# EAGLE schematic avr32break120828 (EAGLE 5.11)

## Sheet 1 of 3
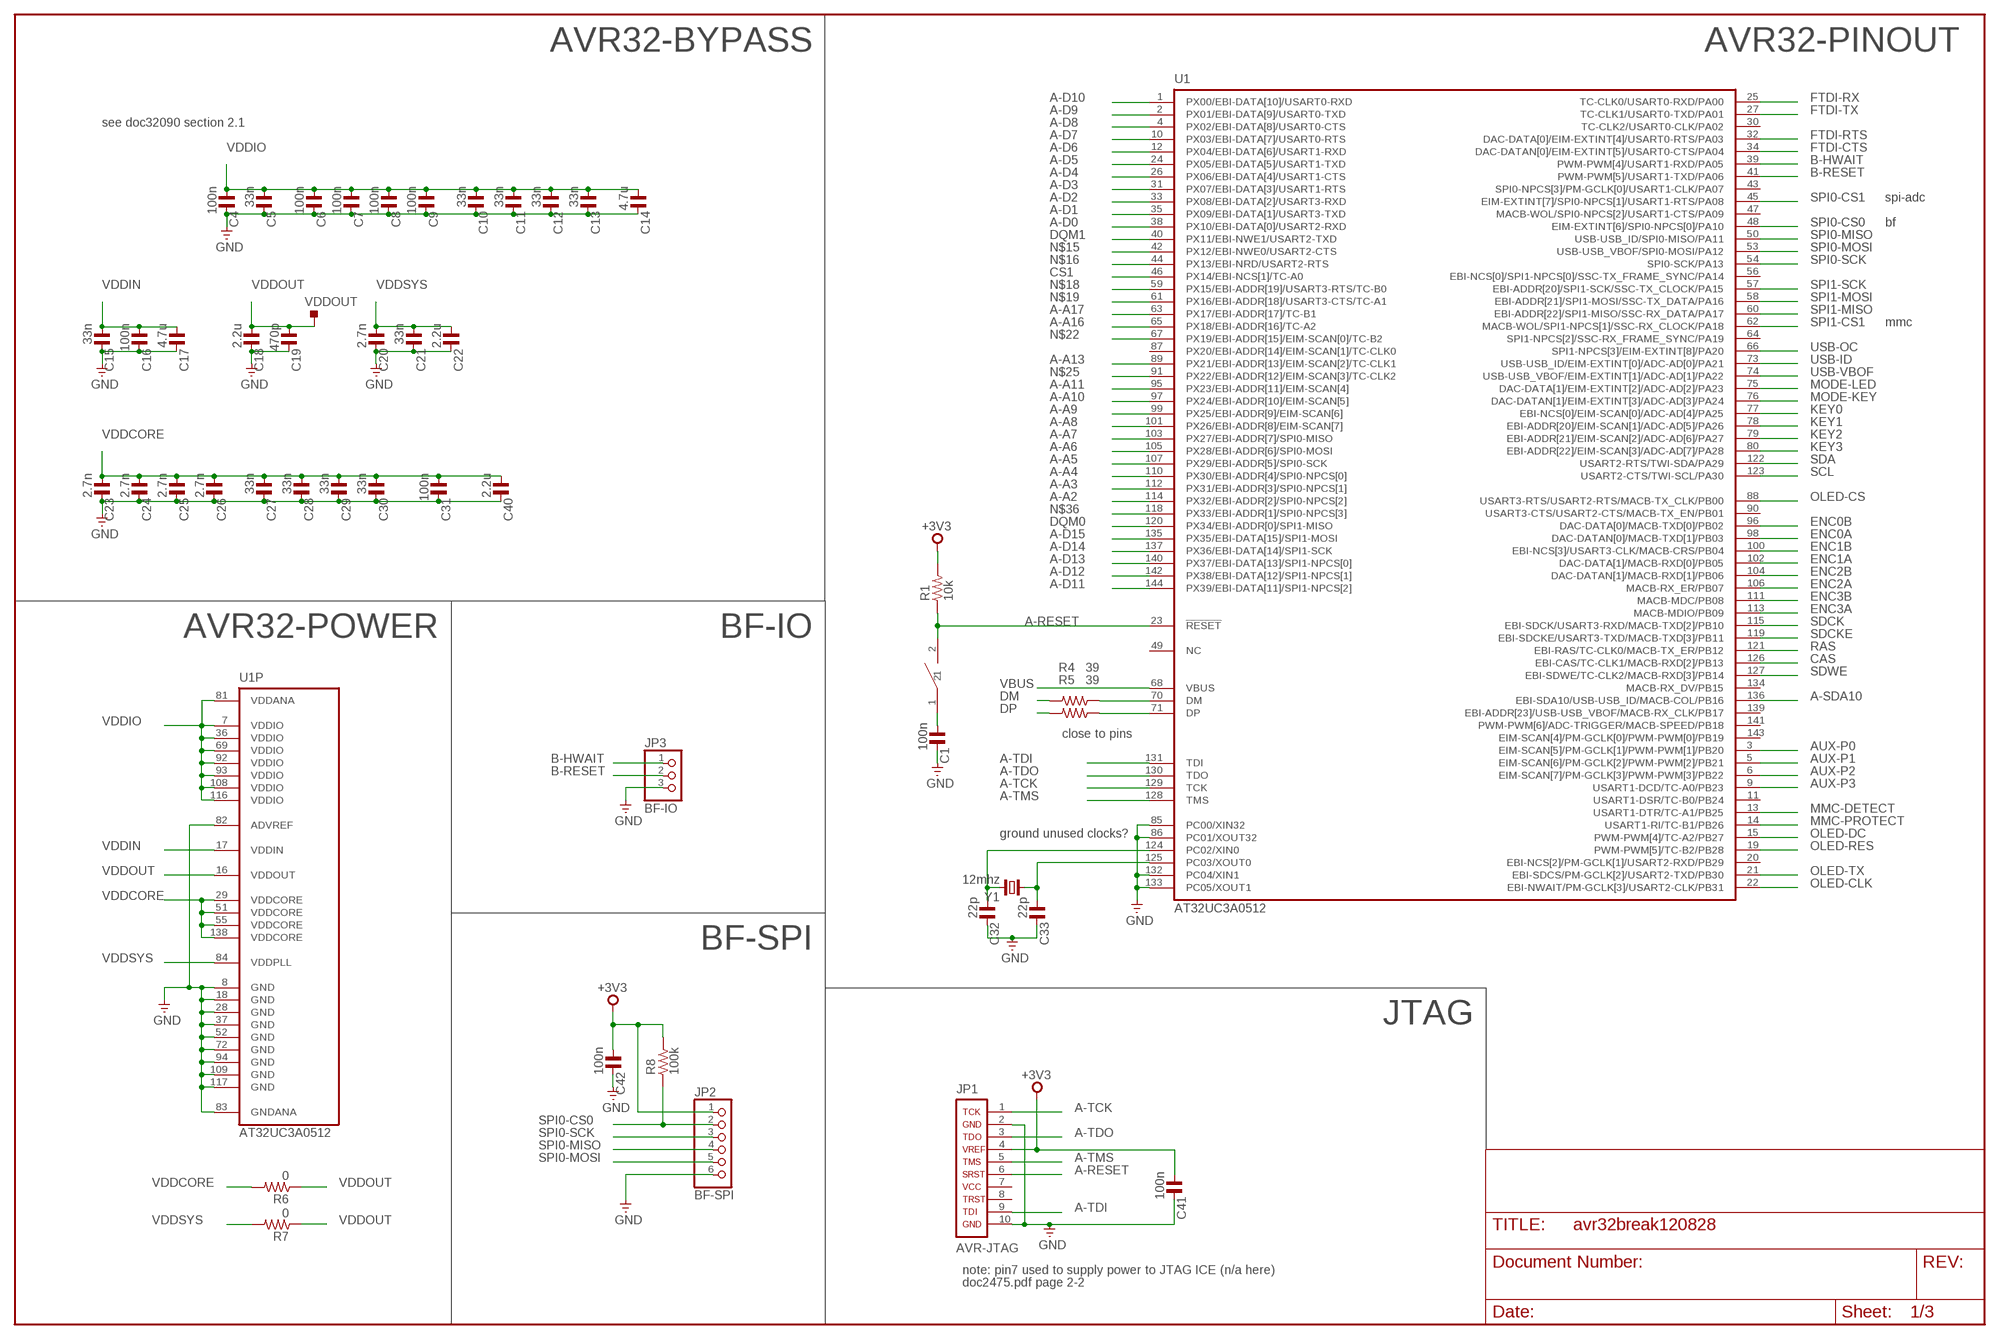
[diagram p0: schematic, sheet 1]

### Parts
C1  100n  C_0603  [C0603]
C4  100n  C_0603  [C0603]
C5  33n  C_0603  [C0603]
C6  100n  C_0603  [C0603]
C7  100n  C_0603  [C0603]
C8  100n  C_0603  [C0603]
C9  100n  C_0603  [C0603]
C10  33n  C_0603  [C0603]
C11  33n  C_0603  [C0603]
C12  33n  C_0603  [C0603]
C13  33n  C_0603  [C0603]
C14  4.7u  C_0603  [C0603]
C15  33n  C_0603  [C0603]
C16  100n  C_0603  [C0603]
C17  4.7u  C_0603  [C0603]
C18  2.2u  C_0603  [C0603]
C19  470p  C_0603  [C0603]
C20  2.7n  C_0603  [C0603]
C21  33n  C_0603  [C0603]
C22  2.2u  C_0603  [C0603]
C23  2.7n  C_0603  [C0603]
C24  2.7n  C_0603  [C0603]
C25  2.7n  C_0603  [C0603]
C26  2.7n  C_0603  [C0603]
C27  33n  C_0603  [C0603]
C28  33n  C_0603  [C0603]
C29  33n  C_0603  [C0603]
C30  33n  C_0603  [C0603]
C31  100n  C_0603  [C0603]
C32  22p  C_0603  [C0603]
C33  22p  C_0603  [C0603]
C40  2.2u  C_0603  [C0603]
C41  100n  C_0603  [C0603]
C42  100n  C_0603  [C0603]
JP1  AVR-JTAG  AVR-JTAG-10  [AVR-JTAG-10]
JP2  BF-SPI  PINHD-1X6  [1X06]
JP3  BF-IO  PINHD-1X3  [1X03]
R1  10k  R_0603  [R0603]
R4  39  R_0603  [R0603]
R5  39  R_0603  [R0603]
R6  0  R_0603  [R0603]
R7  0  R_0603  [R0603]
R8  100k  R_0603  [R0603]
U1  AT32UC3A0512  AT32UC3A0128/0256/0512  [LQFP144]
U$1  PANASONIC-EVQ  [PANASONIC-EVQ]
VDDOUT  TPS-SMD-15RN  [SMD-15RN]
Y1  12mhz  CRYTALHC49UP  [HC49UP]

### Nets
+3V3: C41.1 C42.1 JP1.4 JP2.1 R1.2 R8.2 ; also sheet 2,3
A-A2: U1.114(PX32/EBI-ADDR[2]/SPI0-NPCS[2]) ; also sheet 2
A-A3: U1.112(PX31/EBI-ADDR[3]/SPI0-NPCS[1]) ; also sheet 2
A-A4: U1.110(PX30/EBI-ADDR[4]/SPI0-NPCS[0]) ; also sheet 2
A-A5: U1.107(PX29/EBI-ADDR[5]/SPI0-SCK) ; also sheet 2
A-A6: U1.105(PX28/EBI-ADDR[6]/SPI0-MOSI) ; also sheet 2
A-A7: U1.103(PX27/EBI-ADDR[7]/SPI0-MISO) ; also sheet 2
A-A8: U1.101(PX26/EBI-ADDR[8]/EIM-SCAN[7]) ; also sheet 2
A-A9: U1.99(PX25/EBI-ADDR[9]/EIM-SCAN[6]) ; also sheet 2
A-A10: U1.97(PX24/EBI-ADDR[10]/EIM-SCAN[5]) ; also sheet 2
A-A11: U1.95(PX23/EBI-ADDR[11]/EIM-SCAN[4]) ; also sheet 2
A-A13: U1.89(PX21/EBI-ADDR[13]/EIM-SCAN[2]/TC-CLK1) ; also sheet 2
A-A16: U1.65(PX18/EBI-ADDR[16]/TC-A2) ; also sheet 2
A-A17: U1.63(PX17/EBI-ADDR[17]/TC-B1) ; also sheet 2
A-D0: U1.38(PX10/EBI-DATA[0]/USART2-RXD) ; also sheet 2
A-D1: U1.35(PX09/EBI-DATA[1]/USART3-TXD) ; also sheet 2
A-D2: U1.33(PX08/EBI-DATA[2]/USART3-RXD) ; also sheet 2
A-D3: U1.31(PX07/EBI-DATA[3]/USART1-RTS) ; also sheet 2
A-D4: U1.26(PX06/EBI-DATA[4]/USART1-CTS) ; also sheet 2
A-D5: U1.24(PX05/EBI-DATA[5]/USART1-TXD) ; also sheet 2
A-D6: U1.12(PX04/EBI-DATA[6]/USART1-RXD) ; also sheet 2
A-D7: U1.10(PX03/EBI-DATA[7]/USART0-RTS) ; also sheet 2
A-D8: U1.4(PX02/EBI-DATA[8]/USART0-CTS) ; also sheet 2
A-D9: U1.2(PX01/EBI-DATA[9]/USART0-TXD) ; also sheet 2
A-D10: U1.1(PX00/EBI-DATA[10]/USART0-RXD) ; also sheet 2
A-D11: U1.144(PX39/EBI-DATA[11]/SPI1-NPCS[2]) ; also sheet 2
A-D12: U1.142(PX38/EBI-DATA[12]/SPI1-NPCS[1]) ; also sheet 2
A-D13: U1.140(PX37/EBI-DATA[13]/SPI1-NPCS[0]) ; also sheet 2
A-D14: U1.137(PX36/EBI-DATA[14]/SPI1-SCK) ; also sheet 2
A-D15: U1.135(PX35/EBI-DATA[15]/SPI1-MOSI) ; also sheet 2
A-RESET: JP1.6 R1.1 U1.23(!RESET) U$1.2
A-SDA10: U1.136(EBI-SDA10/USB-USB_ID/MACB-COL/PB16) ; also sheet 2
A-TCK: JP1.1 U1.129(TCK)
A-TDI: JP1.9 U1.131(TDI)
A-TDO: JP1.3 U1.130(TDO)
A-TMS: JP1.5 U1.128(TMS)
AUX-P0: U1.3(EIM-SCAN[5]/PM-GCLK[1]/PWM-PWM[1]/PB20) ; also sheet 3
AUX-P1: U1.5(EIM-SCAN[6]/PM-GCLK[2]/PWM-PWM[2]/PB21) ; also sheet 3
AUX-P2: U1.6(EIM-SCAN[7]/PM-GCLK[3]/PWM-PWM[3]/PB22) ; also sheet 3
AUX-P3: U1.9(USART1-DCD/TC-A0/PB23) ; also sheet 3
B-HWAIT: JP3.1 U1.39(PWM-PWM[4]/USART1-RXD/PA05)
B-RESET: JP3.2 U1.41(PWM-PWM[5]/USART1-TXD/PA06)
CAS: U1.126(EBI-CAS/TC-CLK1/MACB-RXD[2]/PB13) ; also sheet 2
CS1: U1.46(PX14/EBI-NCS[1]/TC-A0) ; also sheet 2
DM: R4.2 ; also sheet 2
DP: R5.2 ; also sheet 2
DQM0: U1.120(PX34/EBI-ADDR[0]/SPI1-MISO) ; also sheet 2
DQM1: U1.40(PX11/EBI-NWE1/USART2-TXD) ; also sheet 2
ENC0A: U1.98(DAC-DATAN[0]/MACB-TXD[1]/PB03) ; also sheet 3
ENC0B: U1.96(DAC-DATA[0]/MACB-TXD[0]/PB02) ; also sheet 3
ENC1A: U1.102(DAC-DATA[1]/MACB-RXD[0]/PB05) ; also sheet 3
ENC1B: U1.100(EBI-NCS[3]/USART3-CLK/MACB-CRS/PB04) ; also sheet 3
ENC2A: U1.106(MACB-RX_ER/PB07) ; also sheet 3
ENC2B: U1.104(DAC-DATAN[1]/MACB-RXD[1]/PB06) ; also sheet 3
ENC3A: U1.113(MACB-MDIO/PB09) ; also sheet 3
ENC3B: U1.111(MACB-MDC/PB08) ; also sheet 3
FTDI-CTS: U1.34(DAC-DATAN[0]/EIM-EXTINT[5]/USART0-CTS/PA04) ; also sheet 2
FTDI-RTS: U1.32(DAC-DATA[0]/EIM-EXTINT[4]/USART0-RTS/PA03) ; also sheet 2
FTDI-RX: U1.25(TC-CLK0/USART0-RXD/PA00) ; also sheet 2
FTDI-TX: U1.27(TC-CLK1/USART0-TXD/PA01) ; also sheet 2
GND: C1.2 C4.2 C5.2 C6.2 C7.2 C8.2 C9.2 C10.2 C11.2 C12.2 C13.2 C14.2 C15.2 C16.2 C17.2 C18.2 C19.2 C20.2 C21.2 C22.2 C23.2 C24.2 C25.2 C26.2 C27.2 C28.2 C29.2 C30.2 C31.2 C32.2 C33.2 C40.2 C41.2 C42.2 JP1.2 JP1.10 JP2.6 JP3.3 U1.8(GND) U1.18(GND) U1.28(GND) U1.37(GND) U1.52(GND) U1.72(GND) U1.82(ADVREF) U1.83(GNDANA) U1.85(PC00/XIN32) U1.86(PC01/XOUT32) U1.94(GND) U1.109(GND) U1.117(GND) U1.132(PC04/XIN1) U1.133(PC05/XOUT1) ; also sheet 2,3
KEY0: U1.77(EBI-NCS[0]/EIM-SCAN[0]/ADC-AD[4]/PA25) ; also sheet 3
KEY1: U1.78(EBI-ADDR[20]/EIM-SCAN[1]/ADC-AD[5]/PA26) ; also sheet 3
KEY2: U1.79(EBI-ADDR[21]/EIM-SCAN[2]/ADC-AD[6]/PA27) ; also sheet 3
KEY3: U1.80(EBI-ADDR[22]/EIM-SCAN[3]/ADC-AD[7]/PA28) ; also sheet 3
MMC-DETECT: U1.13(USART1-DTR/TC-A1/PB25) ; also sheet 2
MMC-PROTECT: U1.14(USART1-RI/TC-B1/PB26) ; also sheet 2
MODE-KEY: U1.76(DAC-DATAN[1]/EIM-EXTINT[3]/ADC-AD[3]/PA24) ; also sheet 3
MODE-LED: U1.75(DAC-DATA[1]/EIM-EXTINT[2]/ADC-AD[2]/PA23) ; also sheet 3
N$2: C1.1 U$1.1
N$4: C32.1 U1.124(PC02/XIN0) Y1.2
N$5: C33.1 U1.125(PC03/XOUT0) Y1.1
N$15: U1.42(PX12/EBI-NWE0/USART2-CTS)
N$16: U1.44(PX13/EBI-NRD/USART2-RTS)
N$18: U1.59(PX15/EBI-ADDR[19]/USART3-RTS/TC-B0)
N$19: U1.61(PX16/EBI-ADDR[18]/USART3-CTS/TC-A1)
N$22: U1.67(PX19/EBI-ADDR[15]/EIM-SCAN[0]/TC-B2)
N$25: U1.91(PX22/EBI-ADDR[12]/EIM-SCAN[3]/TC-CLK2)
N$36: U1.118(PX33/EBI-ADDR[1]/SPI0-NPCS[3])
N$44: R4.1 U1.70(DM)
N$45: R5.1 U1.71(DP)
OLED-CLK: U1.22(EBI-NWAIT/PM-GCLK[3]/USART2-CLK/PB31) ; also sheet 3
OLED-CS: U1.88(USART3-RTS/USART2-RTS/MACB-TX_CLK/PB00) ; also sheet 3
OLED-DC: U1.15(PWM-PWM[4]/TC-A2/PB27) ; also sheet 3
OLED-RES: U1.19(PWM-PWM[5]/TC-B2/PB28) ; also sheet 3
OLED-TX: U1.21(EBI-SDCS/PM-GCLK[2]/USART2-TXD/PB30) ; also sheet 3
RAS: U1.121(EBI-RAS/TC-CLK0/MACB-TX_ER/PB12) ; also sheet 2
SCL: U1.123(USART2-CTS/TWI-SCL/PA30) ; also sheet 3
SDA: U1.122(USART2-RTS/TWI-SDA/PA29) ; also sheet 3
SDCK: U1.115(EBI-SDCK/USART3-RXD/MACB-TXD[2]/PB10) ; also sheet 2
SDCKE: U1.119(EBI-SDCKE/USART3-TXD/MACB-TXD[3]/PB11) ; also sheet 2
SDWE: U1.127(EBI-SDWE/TC-CLK2/MACB-RXD[3]/PB14) ; also sheet 2
SPI0-CS0: JP2.2 R8.1 U1.48(EIM-EXTINT[6]/SPI0-NPCS[0]/PA10)
SPI0-CS1: U1.45(EIM-EXTINT[7]/SPI0-NPCS[1]/USART1-RTS/PA08) ; also sheet 3
SPI0-MISO: JP2.4 U1.50(USB-USB_ID/SPI0-MISO/PA11)
SPI0-MOSI: JP2.5 U1.53(USB-USB_VBOF/SPI0-MOSI/PA12) ; also sheet 3
SPI0-SCK: JP2.3 U1.54(SPI0-SCK/PA13) ; also sheet 3
SPI1-CS1: U1.62(MACB-WOL/SPI1-NPCS[1]/SSC-RX_CLOCK/PA18) ; also sheet 2
SPI1-MISO: U1.60(EBI-ADDR[22]/SPI1-MISO/SSC-RX_DATA/PA17) ; also sheet 2
SPI1-MOSI: U1.58(EBI-ADDR[21]/SPI1-MOSI/SSC-TX_DATA/PA16) ; also sheet 2
SPI1-SCK: U1.57(EBI-ADDR[20]/SPI1-SCK/SSC-TX_CLOCK/PA15) ; also sheet 2
USB-ID: U1.73(USB-USB_ID/EIM-EXTINT[0]/ADC-AD[0]/PA21)
USB-OC: U1.66(SPI1-NPCS[3]/EIM-EXTINT[8]/PA20) ; also sheet 2
USB-VBOF: U1.74(USB-USB_VBOF/EIM-EXTINT[1]/ADC-AD[1]/PA22) ; also sheet 2
VBUS: U1.68(VBUS) ; also sheet 2
VDDCORE: C23.1 C24.1 C25.1 C26.1 C27.1 C28.1 C29.1 C30.1 C31.1 C40.1 R6.2 U1.29(VDDCORE) U1.51(VDDCORE) U1.55(VDDCORE) U1.138(VDDCORE)
VDDIN: C15.1 C16.1 C17.1 U1.17(VDDIN) ; also sheet 2
VDDIO: C4.1 C5.1 C6.1 C7.1 C8.1 C9.1 C10.1 C11.1 C12.1 C13.1 C14.1 U1.7(VDDIO) U1.36(VDDIO) U1.69(VDDIO) U1.81(VDDANA) U1.92(VDDIO) U1.93(VDDIO) U1.108(VDDIO) U1.116(VDDIO) ; also sheet 2
VDDOUT: C18.1 C19.1 R6.1 R7.1 U1.16(VDDOUT) VDDOUT.TP
VDDSYS: C20.1 C21.1 C22.1 R7.2 U1.84(VDDPLL)
Unconnected: JP1.7 JP1.8 U1.11(USART1-DSR/TC-B0/PB24) U1.20(EBI-NCS[2]/PM-GCLK[1]/USART2-RXD/PB29) U1.30(TC-CLK2/USART0-CLK/PA02) U1.43(SPI0-NPCS[3]/PM-GCLK[0]/USART1-CLK/PA07) U1.47(MACB-WOL/SPI0-NPCS[2]/USART1-CTS/PA09) U1.49(NC) U1.56(EBI-NCS[0]/SPI1-NPCS[0]/SSC-TX_FRAME_SYNC/PA14) U1.64(SPI1-NPCS[2]/SSC-RX_FRAME_SYNC/PA19) U1.87(PX20/EBI-ADDR[14]/EIM-SCAN[1]/TC-CLK0) U1.90(USART3-CTS/USART2-CTS/MACB-TX_EN/PB01) U1.134(MACB-RX_DV/PB15) U1.139(EBI-ADDR[23]/USB-USB_VBOF/MACB-RX_CLK/PB17) U1.141(PWM-PWM[6]/ADC-TRIGGER/MACB-SPEED/PB18) U1.143(EIM-SCAN[4]/PM-GCLK[0]/PWM-PWM[0]/PB19)

### Notes on the sheet
- AVR32-BYPASS | AVR32-PINOUT
- see doc32090 section 2.1
- spi-adc
- bf
- mmc
- AVR32-POWER | BF-IO
- close to pins
- ground unused clocks?
- BF-SPI
- JTAG
- note: pin7 used to supply power to JTAG ICE (n/a here)
- doc2475.pdf page 2-2

## Sheet 2 of 3
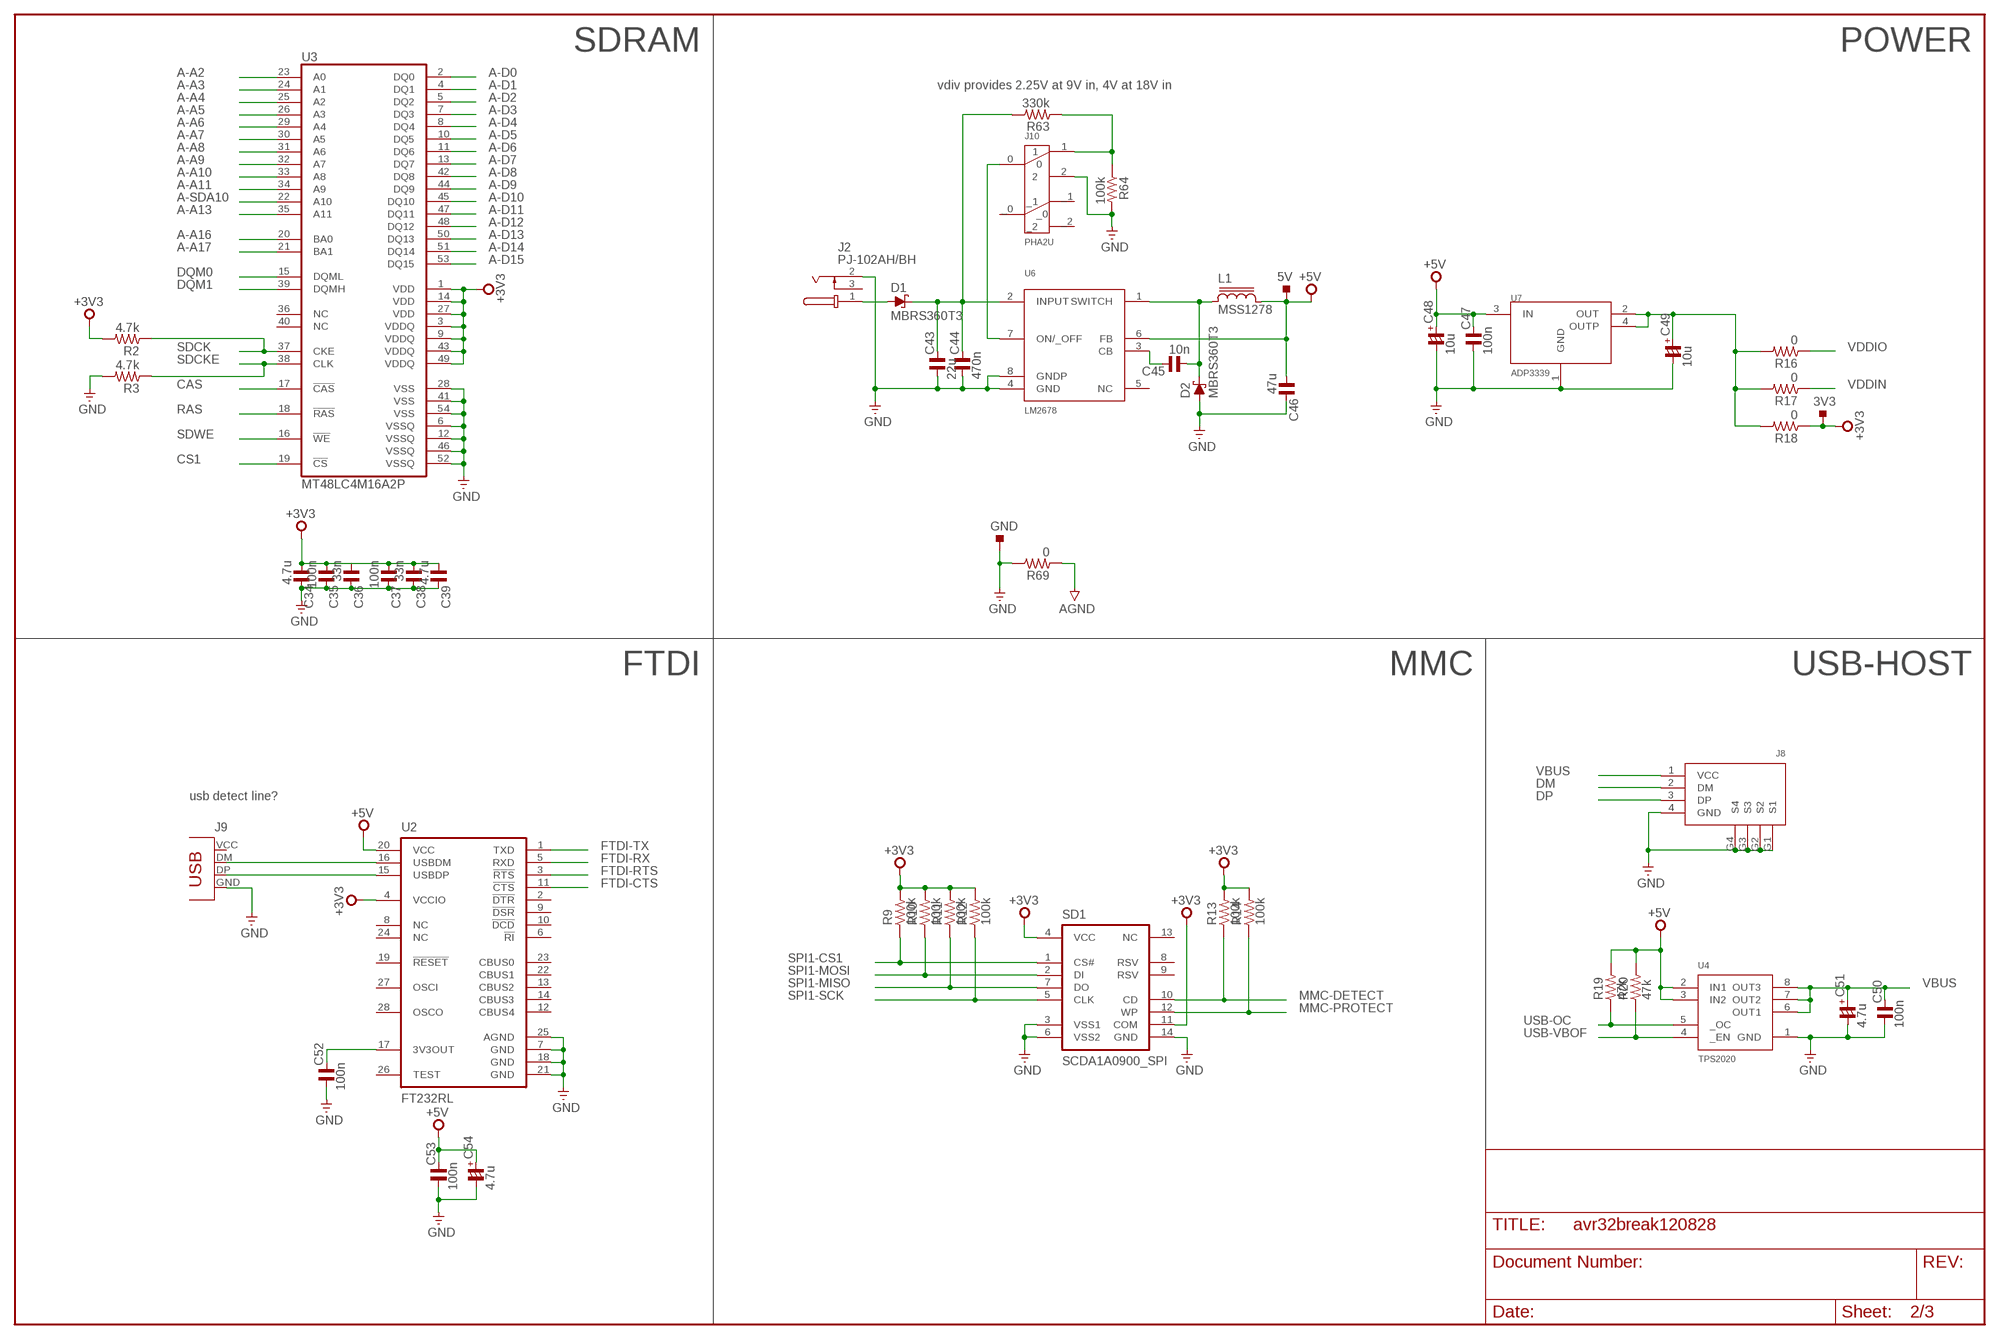
[diagram p1: schematic, sheet 2]

### Parts
3V3  TPS-SMD-15R  [SMD-15R]
5V  TPS-SMD-15R  [SMD-15R]
C34  4.7u  C_0603  [C0603]
C35  100n  C_0603  [C0603]
C36  33n  C_0603  [C0603]
C37  100n  C_0603  [C0603]
C38  33n  C_0603  [C0603]
C39  4.7u  C_0603  [C0603]
C43  22u  C_1206  [C1206]
C44  470n  C_1206  [C1206]
C45  10n  C_1206  [C1206]
C46  47u  C_3225  [C3225]
C47  100n  C_1206  [C1206]
C48  10u  CP_1206/T  [C1206/T]
C49  10u  CP_1206/T  [C1206/T]
C50  100n  C_0603  [C0603]
C51  4.7u  CP_1206/T  [C1206/T]
C52  100n  C_0603  [C0603]
C53  100n  C_0603  [C0603]
C54  4.7u  CP_1206/T  [C1206/T]
D1  MBRS360T3  [SMC]
D2  MBRS360T3  [SMC]
GND  TPS-SMD-20R  [SMD-20R]
J2  PJ-102AH/BH  [PJ-102XH]
J8  USBA-VERT  [USBA-VERT]
J9  USB_TYPE_B  [USB_B]
J10  PHA2U  [PHA2U]
L1  MSS1278  [MSS1278]
R2  4.7k  R_0603  [R0603]
R3  4.7k  R_0603  [R0603]
R9  100k  R_0603  [R0603]
R10  100k  R_0603  [R0603]
R11  100k  R_0603  [R0603]
R12  100k  R_0603  [R0603]
R13  100k  R_0603  [R0603]
R14  100k  R_0603  [R0603]
R16  0  R_0603  [R0603]
R17  0  R_0603  [R0603]
R18  0  R_0603  [R0603]
R19  47k  R_0603  [R0603]
R20  47k  R_0603  [R0603]
R63  330k  R_0603  [R0603]
R64  100k  R_0603  [R0603]
R69  0  R_0603  [R0603]
SD1  SCDA1A0900_SPI  [SCDA1A0900]
U2  FT232RL  [SSOP28]
U3  MT48LC4M16A2P  [TSOP54]
U4  TPS2020  [SO08]
U6  LM2678  [TO263-7]
U7  ADP3339  [SOT223]

### Nets
+3V3: 3V3.TP C34.1 C35.1 C36.1 C37.1 C38.1 C39.1 R2.2 R9.2 R10.2 R11.2 R12.2 R13.2 R14.2 R18.1 SD1.4(VCC) SD1.11(COM) U2.4(VCCIO) U3.1(VDD) U3.3(VDDQ) U3.9(VDDQ) U3.14(VDD) U3.27(VDD) U3.43(VDDQ) U3.49(VDDQ) ; also sheet 1,3
+5V: 5V.TP C46.1 C47.2 C48.+ C53.2 C54.+ L1.2 R19.2 R20.2 U2.20(VCC) U4.2(IN1) U4.3(IN2) U6.6(FB) U7.3(IN) ; also sheet 3
A-A2: U3.23(A0) ; also sheet 1
A-A3: U3.24(A1) ; also sheet 1
A-A4: U3.25(A2) ; also sheet 1
A-A5: U3.26(A3) ; also sheet 1
A-A6: U3.29(A4) ; also sheet 1
A-A7: U3.30(A5) ; also sheet 1
A-A8: U3.31(A6) ; also sheet 1
A-A9: U3.32(A7) ; also sheet 1
A-A10: U3.33(A8) ; also sheet 1
A-A11: U3.34(A9) ; also sheet 1
A-A13: U3.35(A11) ; also sheet 1
A-A16: U3.20(BA0) ; also sheet 1
A-A17: U3.21(BA1) ; also sheet 1
A-D0: U3.2(DQ0) ; also sheet 1
A-D1: U3.4(DQ1) ; also sheet 1
A-D2: U3.5(DQ2) ; also sheet 1
A-D3: U3.7(DQ3) ; also sheet 1
A-D4: U3.8(DQ4) ; also sheet 1
A-D5: U3.10(DQ5) ; also sheet 1
A-D6: U3.11(DQ6) ; also sheet 1
A-D7: U3.13(DQ7) ; also sheet 1
A-D8: U3.42(DQ8) ; also sheet 1
A-D9: U3.44(DQ9) ; also sheet 1
A-D10: U3.45(DQ10) ; also sheet 1
A-D11: U3.47(DQ11) ; also sheet 1
A-D12: U3.48(DQ12) ; also sheet 1
A-D13: U3.50(DQ13) ; also sheet 1
A-D14: U3.51(DQ14) ; also sheet 1
A-D15: U3.53(DQ15) ; also sheet 1
A-SDA10: U3.22(A10) ; also sheet 1
AGND: R69.1 ; also sheet 3
CAS: U3.17(!CAS!) ; also sheet 1
CS1: U3.19(!CS!) ; also sheet 1
DM: J8.2(DM) ; also sheet 1
DP: J8.3(DP) ; also sheet 1
DQM0: U3.15(DQML) ; also sheet 1
DQM1: U3.39(DQMH) ; also sheet 1
FTDI-CTS: U2.11(!CTS!) ; also sheet 1
FTDI-RTS: U2.3(!RTS!) ; also sheet 1
FTDI-RX: U2.5(RXD) ; also sheet 1
FTDI-TX: U2.1(TXD) ; also sheet 1
GND: C34.2 C35.2 C36.2 C37.2 C38.2 C39.2 C43.1 C44.1 C46.2 C47.1 C48.- C49.- C50.1 C51.- C52.1 C53.1 C54.- D2.A GND.TP J2.2(S) J8.4(GND) J8.G1(S1) J8.G2(S2) J8.G3(S3) J8.G4(S4) J9.GND J10.2 R3.2 R64.2 R69.2 SD1.3(VSS1) SD1.6(VSS2) SD1.14(GND) U2.7(GND) U2.18(GND) U2.21(GND) U2.25(AGND) U3.6(VSSQ) U3.12(VSSQ) U3.28(VSS) U3.41(VSS) U3.46(VSSQ) U3.52(VSSQ) U3.54(VSS) U4.1(GND) U6.4(GND) U6.8(GNDP) U7.1(GND) ; also sheet 1,3
MMC-DETECT: R13.1 SD1.10(CD) ; also sheet 1
MMC-PROTECT: R14.1 SD1.12(WP) ; also sheet 1
N$1: C43.2 C44.2 D1.C R63.2 U6.2(INPUT)
N$3: D1.A J2.1(T)
N$7: C45.1 D2.C L1.1 U6.1(SWITCH)
N$9: C45.2 U6.3(CB)
N$12: J9.DM(USBDM) U2.16(USBDM)
N$13: J9.DP(USBDP) U2.15(USBDP)
N$14: C52.2 U2.17(3V3OUT)
N$32: C49.+ R16.2 R17.2 R18.2 U7.2(OUT) U7.4(OUTP)
N$55: J10.1 R63.1 R64.1
N$56: J10.0 U6.7(ON/_OFF)
RAS: U3.18(!RAS!) ; also sheet 1
SDCK: R2.1 U3.37(CKE) ; also sheet 1
SDCKE: R3.1 U3.38(CLK) ; also sheet 1
SDWE: U3.16(!WE!) ; also sheet 1
SPI1-CS1: R9.1 SD1.1(CS#) ; also sheet 1
SPI1-MISO: R11.1 SD1.7(DO) ; also sheet 1
SPI1-MOSI: R10.1 SD1.2(DI) ; also sheet 1
SPI1-SCK: R12.1 SD1.5(CLK) ; also sheet 1
USB-OC: R19.1 U4.5(_OC) ; also sheet 1
USB-VBOF: R20.1 U4.4(_EN) ; also sheet 1
VBUS: C50.2 C51.+ J8.1(VCC) U4.6(OUT1) U4.7(OUT2) U4.8(OUT3) ; also sheet 1
VDDIN: R17.1 ; also sheet 1
VDDIO: R16.1 ; also sheet 1
Unconnected: J2.3(SS) J9.VCC J10._0 J10._1 J10._2 SD1.8(RSV) SD1.9(RSV2) SD1.13(NC) U2.2(!DTR!) U2.6(!RI!) U2.8(NC) U2.9(!DSR!) U2.10(!DCD!) U2.12(CBUS4) U2.13(CBUS2) U2.14(CBUS3) U2.19(!RESET!) U2.22(CBUS1) U2.23(CBUS0) U2.24(NC) U2.26(TEST) U2.27(OSCI) U2.28(OSCO) U3.36(NC) U3.40(NC) U6.5(NC)

### Notes on the sheet
- SDRAM | POWER
- vdiv provides 2.25V at 9V in, 4V at 18V in
- FTDI | MMC | USB-HOST
- usb detect line?

## Sheet 3 of 3
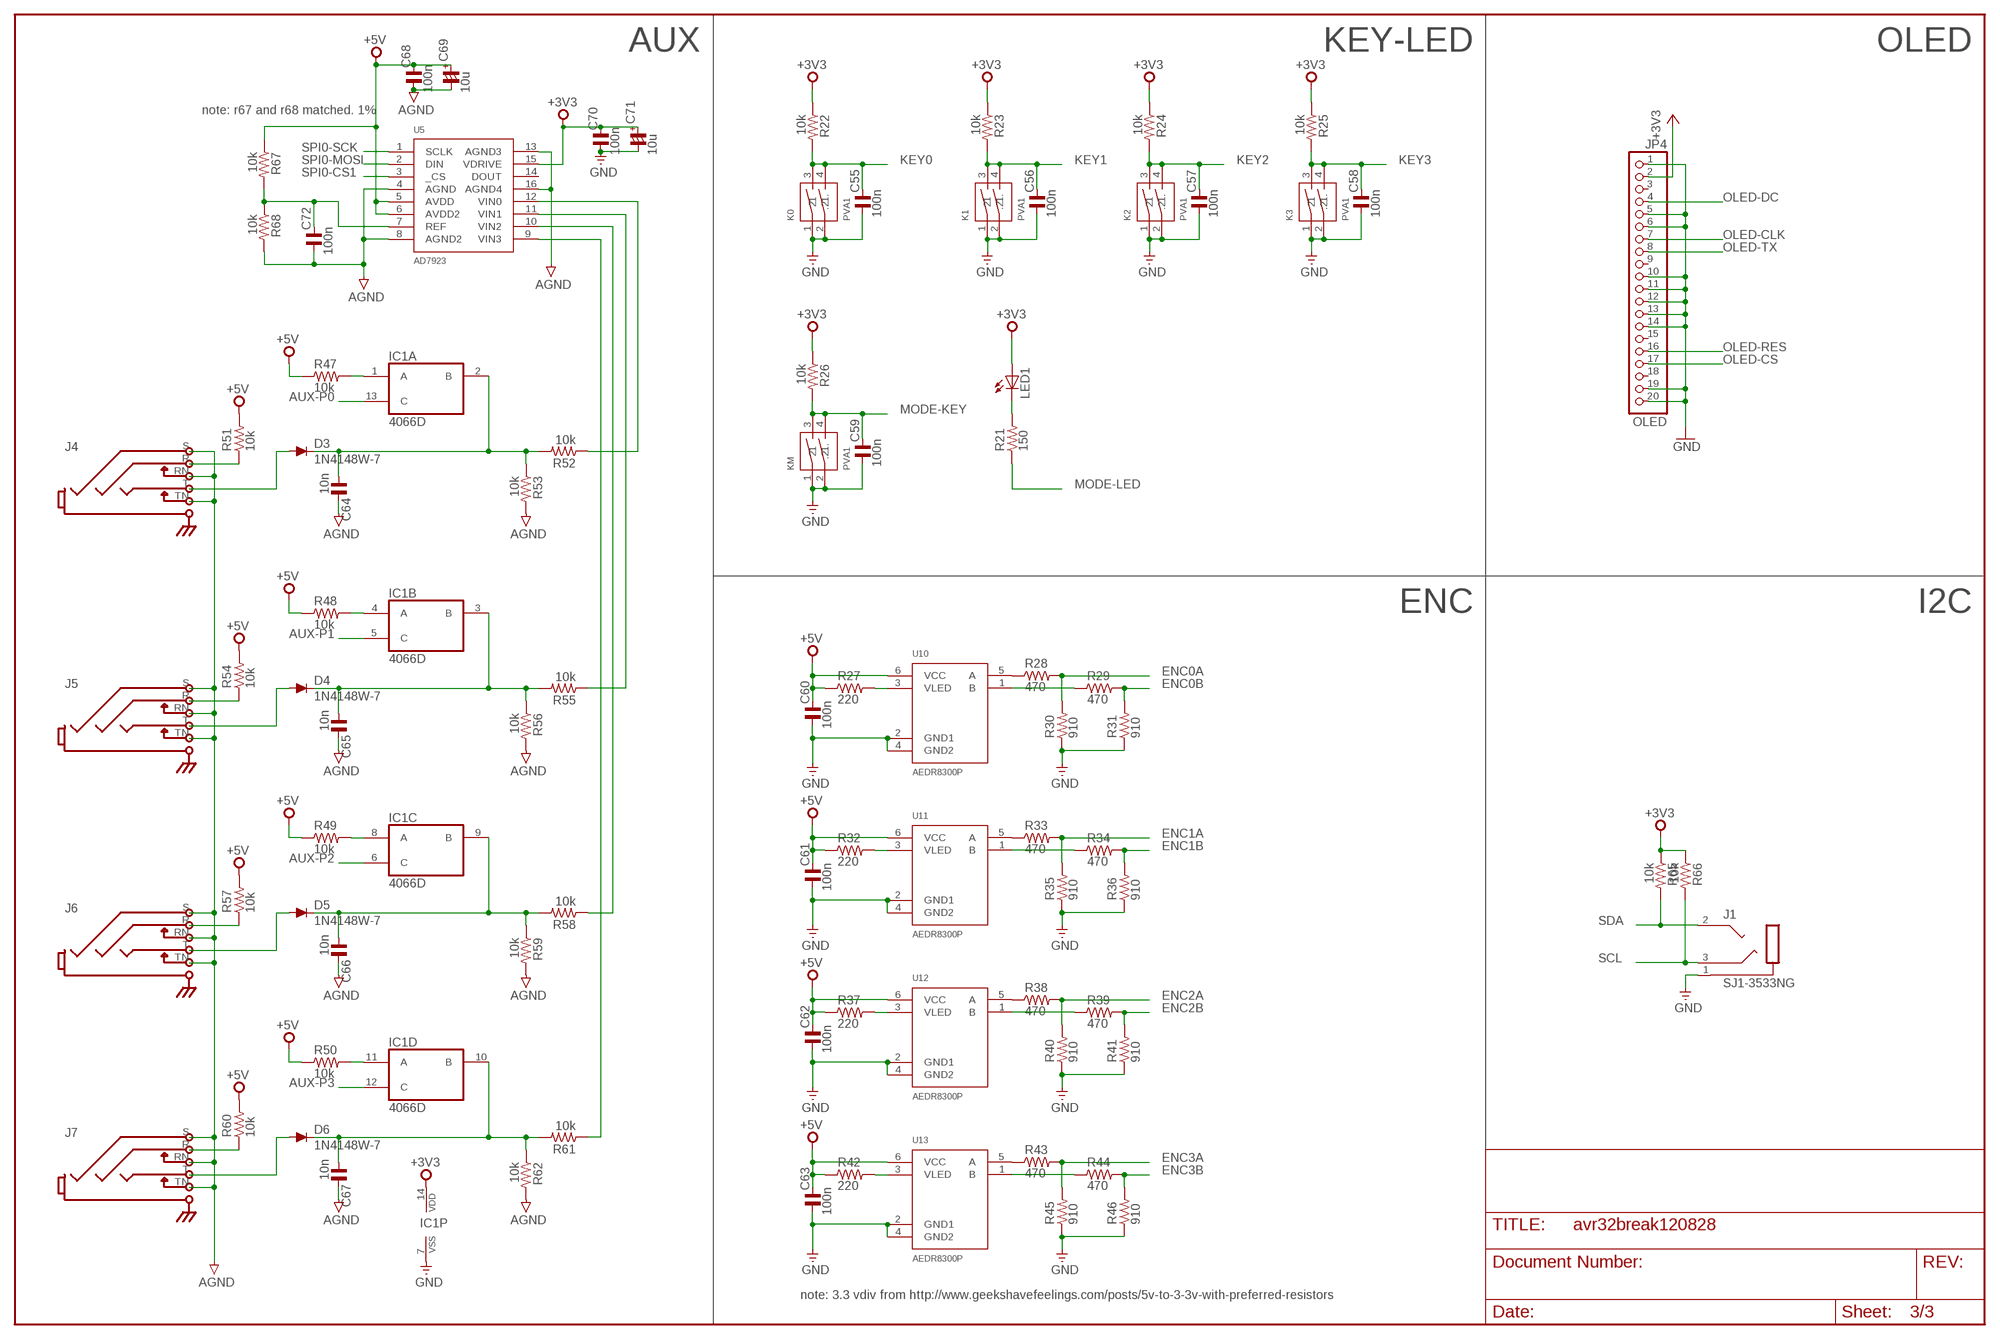
[diagram p2: schematic, sheet 3]

### Parts
C55  100n  C_0603  [C0603]
C56  100n  C_0603  [C0603]
C57  100n  C_0603  [C0603]
C58  100n  C_0603  [C0603]
C59  100n  C_0603  [C0603]
C60  100n  C_0603  [C0603]
C61  100n  C_0603  [C0603]
C62  100n  C_0603  [C0603]
C63  100n  C_0603  [C0603]
C64  10n  C_0603  [C0603]
C65  10n  C_0603  [C0603]
C66  10n  C_0603  [C0603]
C67  10n  C_0603  [C0603]
C68  100n  C_0603  [C0603]
C69  10u  CP_1206/T  [C1206/T]
C70  100n  C_0603  [C0603]
C71  10u  CP_1206/T  [C1206/T]
C72  100n  C_0603  [C0603]
D3  1N4148W-7  [SOD123]
D4  1N4148W-7  [SOD123]
D5  1N4148W-7  [SOD123]
D6  1N4148W-7  [SOD123]
IC1  4066D  [SO14]
J1  SJ1-3533NG  [SJ1-3533NG]
J4  STEREOSW2GND  [NEUTRIK-NRJ6HM-1]
J5  STEREOSW2GND  [NEUTRIK-NRJ6HM-1]
J6  STEREOSW2GND  [NEUTRIK-NRJ6HM-1]
J7  STEREOSW2GND  [NEUTRIK-NRJ6HM-1]
JP4  OLED  PINHD-1X20  [1X20]
K0  PVA1  [PVA1]
K1  PVA1  [PVA1]
K2  PVA1  [PVA1]
K3  PVA1  [PVA1]
KM  PVA1  [PVA1]
LED1  LEDCHIPLED_1206  [CHIPLED_1206]
R21  150  R_0603  [R0603]
R22  10k  R_0603  [R0603]
R23  10k  R_0603  [R0603]
R24  10k  R_0603  [R0603]
R25  10k  R_0603  [R0603]
R26  10k  R_0603  [R0603]
R27  220  R_0603  [R0603]
R28  470  R_0603  [R0603]
R29  470  R_0603  [R0603]
R30  910  R_0603  [R0603]
R31  910  R_0603  [R0603]
R32  220  R_0603  [R0603]
R33  470  R_0603  [R0603]
R34  470  R_0603  [R0603]
R35  910  R_0603  [R0603]
R36  910  R_0603  [R0603]
R37  220  R_0603  [R0603]
R38  470  R_0603  [R0603]
R39  470  R_0603  [R0603]
R40  910  R_0603  [R0603]
R41  910  R_0603  [R0603]
R42  220  R_0603  [R0603]
R43  470  R_0603  [R0603]
R44  470  R_0603  [R0603]
R45  910  R_0603  [R0603]
R46  910  R_0603  [R0603]
R47  10k  R_0603  [R0603]
R48  10k  R_0603  [R0603]
R49  10k  R_0603  [R0603]
R50  10k  R_0603  [R0603]
R51  10k  R_0603  [R0603]
R52  10k  R_0603  [R0603]
R53  10k  R_0603  [R0603]
R54  10k  R_0603  [R0603]
R55  10k  R_0603  [R0603]
R56  10k  R_0603  [R0603]
R57  10k  R_0603  [R0603]
R58  10k  R_0603  [R0603]
R59  10k  R_0603  [R0603]
R60  10k  R_0603  [R0603]
R61  10k  R_0603  [R0603]
R62  10k  R_0603  [R0603]
R65  10k  R_0603  [R0603]
R66  10k  R_0603  [R0603]
R67  10k  R_0603  [R0603]
R68  10k  R_0603  [R0603]
U5  AD7923  [TSSOP16]
U10  AEDR8300P  [AEDR8300]
U11  AEDR8300P  [AEDR8300]
U12  AEDR8300P  [AEDR8300]
U13  AEDR8300P  [AEDR8300]

### Nets
+3V3: C70.2 C71.+ IC1.14(P:VDD) JP4.2 LED1.A R22.1 R23.1 R24.1 R25.1 R26.1 R65.1 R66.1 U5.15(VDRIVE) ; also sheet 1,2
+5V: C60.2 C61.2 C62.2 C63.2 C68.2 C69.+ R27.1 R32.1 R37.1 R42.1 R47.1 R48.1 R49.1 R50.1 R51.2 R54.2 R57.2 R60.2 R67.1 U5.5(AVDD) U5.6(AVDD2) U10.6(VCC) U11.6(VCC) U12.6(VCC) U13.6(VCC) ; also sheet 2
AGND: C64.2 C65.2 C66.2 C67.2 C68.1 C69.- C72.1 J4.RN J4.S J4.TN J5.RN J5.S J5.TN J6.RN J6.S J6.TN J7.RN J7.S J7.TN R53.2 R56.2 R59.2 R62.2 R68.2 U5.4(AGND) U5.8(AGND2) U5.13(AGND3) U5.16(AGND4) ; also sheet 2
AUX-P0: IC1.13(A:C) ; also sheet 1
AUX-P1: IC1.5(B:C) ; also sheet 1
AUX-P2: IC1.6(C:C) ; also sheet 1
AUX-P3: IC1.12(D:C) ; also sheet 1
ENC0A: R28.2 R30.2 ; also sheet 1
ENC0B: R29.2 R31.2 ; also sheet 1
ENC1A: R33.2 R35.2 ; also sheet 1
ENC1B: R34.2 R36.2 ; also sheet 1
ENC2A: R38.2 R40.2 ; also sheet 1
ENC2B: R39.2 R41.2 ; also sheet 1
ENC3A: R43.2 R45.2 ; also sheet 1
ENC3B: R44.2 R46.2 ; also sheet 1
GND: C55.1 C56.1 C57.1 C58.1 C59.1 C60.1 C61.1 C62.1 C63.1 C70.1 C71.- IC1.7(P:VSS) J1.1(S) JP4.1 JP4.5 JP4.6 JP4.10 JP4.11 JP4.12 JP4.13 JP4.14 JP4.19 JP4.20 K0.1 K0.2(1.) K1.1 K1.2(1.) K2.1 K2.2(1.) K3.1 K3.2(1.) KM.1 KM.2(1.) R30.1 R31.1 R35.1 R36.1 R40.1 R41.1 R45.1 R46.1 U10.2(GND1) U10.4(GND2) U11.2(GND1) U11.4(GND2) U12.2(GND1) U12.4(GND2) U13.2(GND1) U13.4(GND2) ; also sheet 1,2
KEY0: C55.2 K0.3 K0.4(.2) R22.2 ; also sheet 1
KEY1: C56.2 K1.3 K1.4(.2) R23.2 ; also sheet 1
KEY2: C57.2 K2.3 K2.4(.2) R24.2 ; also sheet 1
KEY3: C58.2 K3.3 K3.4(.2) R25.2 ; also sheet 1
MODE-KEY: C59.2 KM.3 KM.4(.2) R26.2 ; also sheet 1
MODE-LED: R21.1 ; also sheet 1
N$6: R27.2 U10.3(VLED)
N$8: R28.1 U10.5(A)
N$11: R32.2 U11.3(VLED)
N$17: R33.1 U11.5(A)
N$20: LED1.C R21.2
N$21: R29.1 U10.1(B)
N$23: R34.1 U11.1(B)
N$24: R37.2 U12.3(VLED)
N$26: R38.1 U12.5(A)
N$27: R39.1 U12.1(B)
N$28: R42.2 U13.3(VLED)
N$29: R43.1 U13.5(A)
N$30: R44.1 U13.1(B)
N$31: IC1.1(A:A) R47.2
N$33: J4.R R51.1
N$34: D3.A J4.T
N$35: IC1.11(D:A) R50.2
N$37: IC1.8(C:A) R49.2
N$38: IC1.4(B:A) R48.2
N$39: C64.1 D3.C IC1.2(A:B) R52.2 R53.1
N$40: R52.1 U5.12(VIN0)
N$41: J5.R R54.1
N$42: D4.A J5.T
N$43: C65.1 D4.C IC1.3(B:B) R55.2 R56.1
N$46: R55.1 U5.11(VIN1)
N$47: J6.R R57.1
N$48: D5.A J6.T
N$49: C66.1 D5.C IC1.9(C:B) R58.2 R59.1
N$50: R58.1 U5.10(VIN2)
N$51: J7.R R60.1
N$52: D6.A J7.T
N$53: C67.1 D6.C IC1.10(D:B) R61.2 R62.1
N$54: R61.1 U5.9(VIN3)
N$58: C72.2 R67.2 R68.1 U5.7(REF)
OLED-CLK: JP4.7 ; also sheet 1
OLED-CS: JP4.17 ; also sheet 1
OLED-DC: JP4.4 ; also sheet 1
OLED-RES: JP4.16 ; also sheet 1
OLED-TX: JP4.8 ; also sheet 1
SCL: J1.3(R) R66.2 ; also sheet 1
SDA: J1.2(T) R65.2 ; also sheet 1
SPI0-CS1: U5.3(_CS) ; also sheet 1
SPI0-MOSI: U5.2(DIN) ; also sheet 1
SPI0-SCK: U5.1(SCLK) ; also sheet 1
Unconnected: JP4.3 JP4.9 JP4.15 JP4.18 U5.14(DOUT)

### Notes on the sheet
- AUX | KEY-LED | OLED
- note: r67 and r68 matched. 1%
- ENC | I2C
- note: 3.3 vdiv from http://www.geekshavefeelings.com/posts/5v-to-3-3v-with-preferred-resistors

## Library data of the parts
3V3 5V GND VDDOUT = testpoint:TPS: TEST POINT PAD
C1 C4-C47 C50 C52 C53 C55-C68 C70 C72 = rc-master-smd:C_: NON-POLARIZED CAP
C48 C49 C51 C54 C69 C71 = rc-master-smd:CP_: POLARIZED CAP
D1 D2 = diode:MBRS360T3: Schottkey Power Rectifier - 3A, 60V
D3-D6 = diode:1N4148: DIODE high speed (Philips)
IC1 = 40xx:4066: Quad bilateral ANALOG SWITCH
J1 = con-cuistack:SJ1-3533NG: RIGHT ANGLE STEREO JACK 3.5mm
J2 = con-cuistack:PJ-102AH/BH: DC Power Jack PJ-102AH (2.1 x 5.5 MM) PJ-102BH (2.5 x 5.5 MM)
J4-J7 = Audio Jacks 0.25 inch:STEREOSW2GND: 1/4" stereo jack, switched (unswitched sleeve), with chassis ground connection
J8 = monome-inc:USBA-VERT
J9 = monome-inc:USB_TYPE_B: BERG USB connector
J10 = monome-inc:PHA2U
JP1 = atmel-avr32:AVR-JTAG-10: AVR JTAG Debug/Programming Header
JP2 = pinhead:PINHD-1X6: PIN HEADER
JP3 = pinhead:PINHD-1X3: PIN HEADER
JP4 = pinhead:PINHD-1X20: PIN HEADER
K0 K1-K3 KM = monome-inc:PVA1
L1 = inductor-coilcraft:MSS1278: SMT Power Inductor
LED1 = led:LED: LED OSRAM: - CHIPLED LG R971, LG N971, LY N971, LG Q971, LY Q971, LO R971, LY R971 LH N974, LH R974 LS Q976, LO Q976, LY Q976 LO Q996 - Hyper CHIPLED LW Q18S LB Q993, LB Q99A, LB R99A - SideLED LS A670, LO A670, LY A670, LG A670, LP A670 LB A673, LV A673, LT A673, LW A673 LH A674 LY A675 LS A676, LA A676, LO A676, LY A676, LW A676 LS A679, LY A679, LG A679 - Hyper Micro SIDELED® LS Y876, LA Y876, LO Y876, LY Y876 LT Y87S - SmartLED LW L88C, LW L88S LB L89C, LB L89S, LG L890 LS L89K, LO L89K, LY L89K LS L896, LA L896, LO L896, LY L896 - TOPLED LS T670, LO T670, LY T670, LG T670, LP T670 LSG T670, LSP T670, LSY T670, LOP T670, LYG T670 LG T671, LOG T671, LSG T671 LB T673, LV T673, LT T673, LW T673 LH T674 LS T676, LA T676, LO T676, LY T676, LB T676, LH T676, LSB T676, LW T676 LB T67C, LV T67C, LT T67C, LS T67K, LO T67K, LY T67K, LW E67C LS E67B, LA E67B, LO E67B, LY E67B, LB E67C, LV E67C, LT E67C LW T67C LS T679, LY T679, LG T679 LS T770, LO T770, LY T770, LG T770, LP T770 LB T773, LV T773, LT T773, LW T773 LH T774 LS E675, LA E675, LY E675, LS T675 LS T776, LA T776, LO T776, LY T776, LB T776 LHGB T686 LT T68C, LB T68C - Hyper Mini TOPLED® LB M676 - Mini TOPLED Santana® LG M470 LS M47K, LO M47K, LY M47K Source: http://www.osram.convergy.de LUXEON: - LUMILED® LXK2-PW12-R00, LXK2-PW12-S00, LXK2-PW14-U00, LXK2-PW14-V00 LXK2-PM12-R00, LXK2-PM12-S00, LXK2-PM14-U00 LXK2-PE12-Q00, LXK2-PE12-R00, LXK2-PE12-S00, LXK2-PE14-T00, LXK2-PE14-U00 LXK2-PB12-K00, LXK2-PB12-L00, LXK2-PB12-M00, LXK2-PB14-N00, LXK2-PB14-P00, LXK2-PB14-Q00 LXK2-PR12-L00, LXK2-PR12-M00, LXK2-PR14-Q00, LXK2-PR14-R00 LXK2-PD12-Q00, LXK2-PD12-R00, LXK2-PD12-S00 LXK2-PH12-R00, LXK2-PH12-S00 LXK2-PL12-P00, LXK2-PL12-Q00, LXK2-PL12-R00 Source: www.luxeon.com KINGBRIGHT: KA-3528ASYC Source: www.kingbright.com
R1-R14 R16-R69 = rc-master-smd:R_: RESISTOR
SD1 = con-alps:SCDA1A0900_SPI: SD Memory Connector (SPI Mode)
U1 = atmel-avr32:AT32UC3A0128/0256/0512: AT32UC3A0128/0256/0512
U2 = ftdi-chip:FT232RL: USB UART
U3 = memory-micron:MT48LC4M16A2P: SDRAM 1 Meg x 16 x 4 banks
U4 = monome-inc:TPS2020
U5 = monome-inc:AD7923
U6 = monome-inc:LM2678
U7 = monome-inc:ADP3339
U10-U13 = monome-inc:AEDR8300P
U$1 = monome-inc:PANASONIC-EVQ
Y1 = crystal:CRYTAL: CRYSTAL